# Altium project 5GHz.PrjPCB
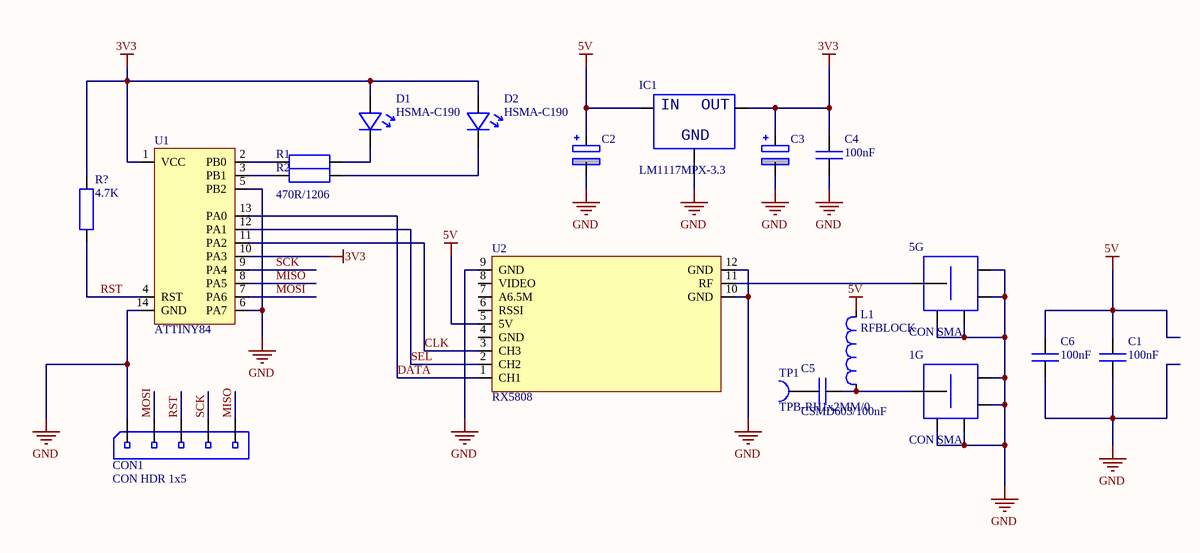
[diagram p0: 5GHz.SchDoc]
1 sheet, 19 parts. Net scope: global (net labels, ports and power ports of the same name join across sheets).
Board file: 5GHz.PcbDoc

## Sheet 5GHz.SchDoc
size A4

### Parts
1G  CON SMA  [con SMA (recht)]
5G  CON SMA  [con SMA (recht)]
C1  100nF  [smd C1206]
C2  CSMD1206/10uF/10V  [smd C1206 polar]  (value not drawn)
C3  CSMD1206/10uF/10V  [smd C1206 polar]  (value not drawn)
C4  100nF  [smd C1206]
C5  CSMD603/100nF  [smd C0603_0.80]
C6  100nF  [smd C1206]
CON1  CON HDR 1x5  [hdr 1x5]
D1  HSMA-C190  [led HSMH-C190 (Avago Technologies)]
D2  HSMA-C190  [led HSMH-C190 (Avago Technologies)]
IC1  LM1117MPX-3.3  [smd SOT-223]
L1  RFBLOCK  [smd C0603]
R1  470R/1206  [smd C1206_0.55]
R2  470R/1206  [smd C1206_0.55]  (value not drawn)
R?  4.7K  [smd C1206_0.55]
TP1  TPB-RH1x2MM/0  [TESTPOINT (pad RH 1x2mm/0)]
U1  ATTINY84  [SOIC127P600X175-14N]
U2  RX5808  [RX5808]

### Nets
3V3: C3.1 C4.2 D1.1 D2.1 IC1.2 R?.2 U1.1(VCC) U1.10(PA3)
5V: C1.2 C2.1 C6.2 IC1.3 L1.2 U2.5(5V)
GND: 1G.2 1G.3 1G.4 1G.5 5G.2 5G.3 5G.4 5G.5 C1.1 C2.2 C3.2 C4.1 C6.1 CON1.1 IC1.1 U1.5(PB2) U1.6(PA7) U1.14(GND) U2.9(GND) U2.10(GND) U2.12(GND)
CLK: U1.11(PA2) U2.3(CH3)
DATA: U1.13(PA0) U2.1(CH1)
MISO: CON1.5 U1.8(PA5)
MOSI: CON1.2 U1.7(PA6)
RST: CON1.3 R?.1 U1.4(RST)
SCK: CON1.4 U1.9(PA4)
SEL: U1.12(PA1) U2.2(CH2)
Net1G_1: 1G.1 C5.2 L1.1
Net5G_1: 5G.1 U2.11(RF)
NetC5_1: C5.1 TP1.1
NetD1_2: D1.2 R1.2
NetD2_2: D2.2 R2.2
NetR1_1: R1.1 U1.2(PB0)
NetR2_1: R2.1 U1.3(PB1)

Not connected (* = marked no-connect by the designer): U2 4(GND) 6(RSSI) 7(A6.5M) 8(VIDEO)

### Notes on the sheet
- (in symbol LM1117MPX-3.3) IN; OUT; GND

### Library data of the parts
1G 5G = CON SMA: SMA connector, rechtop; Part Number: CON SMA; Component Kind: Standard; Component Type: Standard; Designator: CON SMA; Pin Count: 5
C1 C4 C6 = CSMD1206/100nF: smd capaciteit, verp.1206, 100nF; Part Number: CSMD1206/100nF; Component Kind: Standard; Component Type: Standard; Designator: CSMD1206/100nF; Pin Count: 2
C2 C3 = CSMD1206/10uF/10V: smd capaciteit, tantalium, verp.1206, 10uF/10V; Part Number: CSMD1206/10uF/10V; Component Kind: Standard; Component Type: Standard; Designator: CSMD1206/10uF/10V; Pin Count: 2
C5 = CSMD603/100nF: smd capaciteit, verp.0603, 100nF; Part Number: CSMD603/100nF; Component Kind: Standard; Component Type: Standard; Designator: CSMD603/100nF; Pin Count: 2
CON1 = CON HDR 1x5: pcb header recht 1x5  pitch 100mil; Part Number: CON HDR 1x5; Component Kind: Standard; Component Type: Standard; Designator: CON HDR 1x5; Pin Count: 5
D1 D2 = HSMA-C190: led smd amber, Avago Techn., HSMA-C190
IC1 = LM1117MPX-3.3: low dropout linear regulator, 3.3V 800mA, SOT-223; Part Number: LM1117MPX-3.3; Component Kind: Standard; Component Type: Standard; Designator: LM1117MPX-3.3; Pin Count: 3
L1 = SPL603/100nH: Part Number: SPL603/100nH; Component Kind: Standard; Component Type: Standard; Designator: SPL603/100nH; Pin Count: 2
R1 R2 R? = 470R/1206: weerstand SMD1206, 470R
TP1 = TPB-RH1x2MM/0: testpunt, boog-symbool, pad rechthoekig 1x2mm/0; Part Number: TPB-RH1x2MM/0; Component Kind: Standard; Component Type: Standard; Designator: TPB-RH1x2MM/0; Pin Count: 1